# Altium project opm.PrjPcb (part 11 of 11)

## Sheet thermal.SchDoc: Thermal Monitoring
size A4; Author: Peilin Perry Xu; CompanyName: N/A; DrawnBy: Peilin Perry Xu; Engineer: Peilin Perry Xu; Organization: N/A; Address1: 89 Chestnut Street, Toronto. ON, Canada; Address2: 79 Brass Drive, Richmond Hill, ON, Canada; DocumentNumber: 7; Revision: 2; SheetNumber: 10; SheetTotal: 11
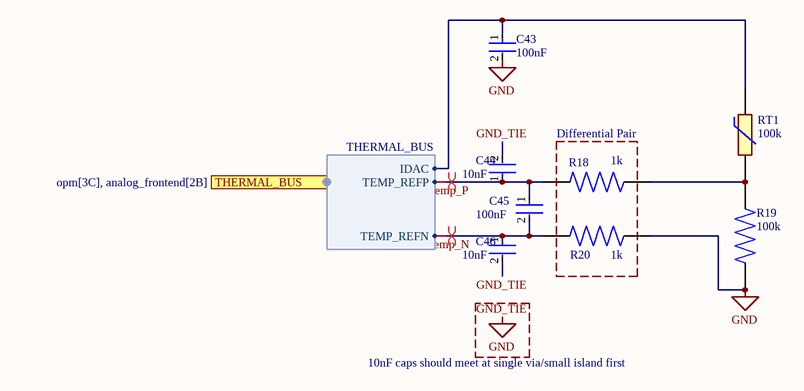
[diagram p10: thermal.SchDoc]

### Parts
C43  100nF  [GRM3195C1H104JA05D]
C44  10nF  [GRM1885C1H103JA01D]
C45  100nF  [GRM3195C1H104JA05D]
C46  10nF  [GRM1885C1H103JA01D]
R18  1k  [RESC1508X55N]
R19  100k  [RESC1508X55N]
R20  1k  [RESC1508X55N]
RT1  100k  [104JT-025]

### Blocks framed on the sheet
Differential Pair: R18 R20

### Ports
THERMAL_BUS (harness THERMAL_BUS, see opm[3C], analog_frontend[2B])

### Harnesses
THERMAL_BUS: IDAC, TEMP_REFN, TEMP_REFP

### Nets
GND: C43.2 C44.2 C46.2 R19.2 R20.2  [also labelled GND_TIE]  [project net DGND]
Temp_N: C45.2 C46.1 R20.1 ; port THERMAL_BUS.TEMP_REFN
Temp_P: C44.1 C45.1 R18.1 ; port THERMAL_BUS.TEMP_REFP
NetC43_1: C43.1 RT1.1 ; port THERMAL_BUS.IDAC
NetR18_2: R18.2 R19.1 RT1.2

### Layout directives
differential pair: Temp_N, Temp_P

### Notes on the sheet
- 10nF caps should meet at single via/small island first

### Library data of the parts
C43 C45 = GRM3195C1H104JA05D: 50V 100nF C0G ±5% 1206 Multilayer Ceramic Capacitors MLCC - SMD/SMT ROHS; Manufacturer: Murata; Manufacturer Lifecycle Status: IN PRODUCTION; Temperature Coefficient: 30ppm/°C; Supplier: DigiKey; Supplier Part Number: 490-GRM3195C1H104JA05DCT-ND; Manufacturer Part Number: GRM3195C1H104JA05D; RoHS: Compliant; Category: Ceramic Capacitors; Stock: 3015; Pricing: 1=0.34, 10=0.199, 50=0.146, 100=0.1298, 500=0.10224, 1000=0.09376 (USD); Value: 100nF; Case/Package: 1206; Dielectric Material: Ceramic; Height: 850µm; Length: 3.2mm; Lifecycle Status: Production; Material: Ceramic; Max Operating Temperature: 125°C; Min Operating Temperature: -55°C; Mounting Technology: Surface Mount; Number of Terminals: 2; REACH SVHC: Yes; Thickness: 850µm; Tolerance: 5%; Voltage Rating: 50V; Voltage Rating (DC): 50V; Width: 1.6mm; ComponentLink1URL: https://datasheet.octopart.com:443/GRM3195C1H104JA05D-Murata-datasheet-141279025.pdf?src-supplier=Geoflip; ComponentLink1Description: https://datasheet.octopart.com:443/GRM3195C1H104JA05D-Murata-datasheet-141279025.pdf?src-supplier=Geoflip; ComponentLink2URL: https://datasheet.octopart.com:443/GRM3195C1H104JA05D-Murata-datasheet-165579666.pdf?src-supplier=TME; ComponentLink2Description: https://datasheet.octopart.com:443/GRM3195C1H104JA05D-Murata-datasheet-165579666.pdf?src-supplier=TME; ComponentLink3URL: https://datasheet.octopart.com:443/GRM3195C1H104JA05D-Murata-datasheet-140707903.pdf?src-supplier=Ciiva; ComponentLink3Description: https://datasheet.octopart.com:443/GRM3195C1H104JA05D-Murata-datasheet-140707903.pdf?src-supplier=Ciiva; ComponentLink4URL: https://datasheet.octopart.com:443/GRM3195C1H104JA05D-Murata-datasheet-138745203.pdf?src-supplier=Ciiva; ComponentLink4Description: https://datasheet.octopart.com:443/GRM3195C1H104JA05D-Murata-datasheet-138745203.pdf?src-supplier=Ciiva; ComponentLink5URL: https://datasheet.octopart.com/GRM3195C1H104JA05D-Murata-datasheet-12515295.pdf; ComponentLink5Description: https://datasheet.octopart.com/GRM3195C1H104JA05D-Murata-datasheet-12515295.pdf; ComponentLink6URL: https://datasheet.octopart.com/GRM3195C1H104JA05D-Murata-datasheet-12510076.pdf; ComponentLink6Description: https://datasheet.octopart.com/GRM3195C1H104JA05D-Murata-datasheet-12510076.pdf; ComponentLink7URL: https://datasheet.octopart.com/GRM3195C1H104JA05D-Murata-datasheet-11978611.pdf; ComponentLink7Description: https://datasheet.octopart.com/GRM3195C1H104JA05D-Murata-datasheet-11978611.pdf; ComponentLink8URL: https://datasheet.octopart.com/GRM3195C1H104JA05D-Murata-datasheet-10025737.pdf; ComponentLink8Description: https://datasheet.octopart.com/GRM3195C1H104JA05D-Murata-datasheet-10025737.pdf; ComponentLink9URL: https://datasheet.octopart.com/GRM3195C1H104JA05D-Murata-datasheet-8819587.pdf; ComponentLink9Description: https://datasheet.octopart.com/GRM3195C1H104JA05D-Murata-datasheet-8819587.pdf; ComponentLink10URL: http://sigma.octopart.com:80/reach_statement/Murata-company-16.pdf?src-supplier=Compliance+Statements; ComponentLink10Description: http://sigma.octopart.com:80/reach_statement/Murata-company-16.pdf?src-supplier=Compliance+Statements; Supplier 1: DigiKey; Supplier Part Number 1: 490-GRM3195C1H104JA05DCT-ND
C44 C46 = GRM1885C1H103JA01D: Multilayer Ceramic Capacitor, Grm Series, 0.01 F, 5%, C0g / Np0, 50 V, 0603 [1608 Metric]; Manufacturer: Murata; Manufacturer Lifecycle Status: IN PRODUCTION; Temperature Coefficient: 30ppm/°C; Voltage: 50V; Supplier: DigiKey; Supplier Part Number: 490-9666-1-ND; Manufacturer Part Number: GRM1885C1H103JA01D; RoHS: Compliant; Category: Ceramic Capacitors; Stock: 561745; Pricing: 1=0.12, 10=0.064, 50=0.0446, 100=0.0386, 500=0.02864, 1000=0.02721 (USD); Value: 10nF; Case/Package: 0603; Case Code (Imperial): 0603; Case Code (Metric): 1608; Depth: 800µm; Dielectric: C0G; Dielectric Material: Ceramic; Height: 800µm; Lead Free: Lead Free; Lead Pitch: 500µm; Length: 1.6mm; Lifecycle Status: Production; Material: Ceramic; Max Operating Temperature: 125°C; Min Operating Temperature: -55°C; Mounting Technology: Surface Mount; Number of Terminals: 2; Packaging: Cut Tape; REACH SVHC: Yes; Schedule B: 8532240020, 8532240020|8532240020, 8532240020|8532240020|8532240020, 8532240020|8532240020|8532240020|8532240020; Termination: SMD/SMT; Thickness: 800µm; Tolerance: 5%; Voltage Rating: 50V; Voltage Rating (DC): 50V; Width: 800µm; ComponentLink1URL: https://datasheet.octopart.com:443/GRM1885C1H103JA01D-Murata-datasheet-34231350.pdf?src-supplier=Newark; ComponentLink1Description: https://datasheet.octopart.com:443/GRM1885C1H103JA01D-Murata-datasheet-34231350.pdf?src-supplier=Newark; ComponentLink2URL: https://datasheet.octopart.com:443/GRM1885C1H103JA01D-Murata-datasheet-62317145.pdf?src-supplier=element14+APAC; ComponentLink2Description: https://datasheet.octopart.com:443/GRM1885C1H103JA01D-Murata-datasheet-62317145.pdf?src-supplier=element14+APAC; ComponentLink3URL: https://datasheet.octopart.com:443/GRM1885C1H103JA01D-Murata-datasheet-15634865.pdf?src-supplier=Future+Electronics; ComponentLink3Description: https://datasheet.octopart.com:443/GRM1885C1H103JA01D-Murata-datasheet-15634865.pdf?src-supplier=Future+Electronics; ComponentLink4URL: https://datasheet.octopart.com:443/GRM1885C1H103JA01D-Murata-datasheet-22122223.pdf?src-supplier=Future+Electronics; ComponentLink4Description: https://datasheet.octopart.com:443/GRM1885C1H103JA01D-Murata-datasheet-22122223.pdf?src-supplier=Future+Electronics; ComponentLink5URL: https://datasheet.octopart.com:443/GRM1885C1H103JA01D-Murata-datasheet-44106831.pdf?src-supplier=Future+Electronics; ComponentLink5Description: https://datasheet.octopart.com:443/GRM1885C1H103JA01D-Murata-datasheet-44106831.pdf?src-supplier=Future+Electronics; ComponentLink6URL: https://datasheet.octopart.com:443/GRM1885C1H103JA01D-Murata-datasheet-165579666.pdf?src-supplier=TME; ComponentLink6Description: https://datasheet.octopart.com:443/GRM1885C1H103JA01D-Murata-datasheet-165579666.pdf?src-supplier=TME; ComponentLink7URL: https://datasheet.octopart.com:443/GRM1885C1H103JA01D-Murata-datasheet-86177052.pdf?src-supplier=TME; ComponentLink7Description: https://datasheet.octopart.com:443/GRM1885C1H103JA01D-Murata-datasheet-86177052.pdf?src-supplier=TME; ComponentLink8URL: https://datasheet.octopart.com:443/GRM1885C1H103JA01D-Murata-datasheet-141274262.pdf?src-supplier=Ciiva; ComponentLink8Description: https://datasheet.octopart.com:443/GRM1885C1H103JA01D-Murata-datasheet-141274262.pdf?src-supplier=Ciiva; ComponentLink9URL: https://datasheet.octopart.com:443/GRM1885C1H103JA01D-Murata-datasheet-140695819.pdf?src-supplier=Ciiva; ComponentLink9Description: https://datasheet.octopart.com:443/GRM1885C1H103JA01D-Murata-datasheet-140695819.pdf?src-supplier=Ciiva; ComponentLink10URL: https://datasheet.octopart.com:443/GRM1885C1H103JA01D-Murata-datasheet-138741457.pdf?src-supplier=Ciiva; ComponentLink10Description: https://datasheet.octopart.com:443/GRM1885C1H103JA01D-Murata-datasheet-138741457.pdf?src-supplier=Ciiva; ComponentLink11URL: https://datasheet.octopart.com/GRM1885C1H103JA01D-Murata-datasheet-12515295.pdf; ComponentLink11Description: https://datasheet.octopart.com/GRM1885C1H103JA01D-Murata-datasheet-12515295.pdf; ComponentLink12URL: https://datasheet.octopart.com/GRM1885C1H103JA01D-Murata-datasheet-12510076.pdf; ComponentLink12Description: https://datasheet.octopart.com/GRM1885C1H103JA01D-Murata-datasheet-12510076.pdf; ComponentLink13URL: https://datasheet.octopart.com/GRM1885C1H103JA01D-Murata-datasheet-11978611.pdf; ComponentLink13Description: https://datasheet.octopart.com/GRM1885C1H103JA01D-Murata-datasheet-11978611.pdf; ComponentLink14URL: https://datasheet.octopart.com/GRM1885C1H103JA01D-Murata-datasheet-10025737.pdf; ComponentLink14Description: https://datasheet.octopart.com/GRM1885C1H103JA01D-Murata-datasheet-10025737.pdf; ComponentLink15URL: https://datasheet.octopart.com/GRM1885C1H103JA01D-Murata-datasheet-8819587.pdf; ComponentLink15Description: https://datasheet.octopart.com/GRM1885C1H103JA01D-Murata-datasheet-8819587.pdf; ComponentLink16URL: http://sigma.octopart.com:80/reach_statement/Murata-company-16.pdf?src-supplier=Compliance+Statements; ComponentLink16Description: http://sigma.octopart.com:80/reach_statement/Murata-company-16.pdf?src-supplier=Compliance+Statements; Supplier 1: DigiKey; Supplier Part Number 1: 490-9666-1-ND
R18 R20 = TNPW06031K00BXEN: Fixed Resistor, Thin Film, 0.1W, 1000ohm, 75V, 0.1% +/-Tol, 15ppm/Cel, Surface Mount, 0603; Manufacturer: Vishay; Max Power Dissipation: 100mW; Value: 1kΩ; Temperature Coefficient: 15ppm/°C; Supplier: DigiKey; Supplier Part Number: 541-1724-1-ND; Manufacturer Part Number: TNPW06031K00BXEN; RoHS: Compliant; Category: Chip SMD Resistors; Stock: 1829; Pricing: 1=0.66, 10=0.548, 25=0.5076, 50=0.4798, 100=0.454, 250=0.42332, 500=0.40256 (USD); Case/Package: 0603; Case Code (Imperial): 0603; Case Code (Metric): 1608; China RoHS: Compliant; Composition: Thin Film; Contact Plating: Tin; Country of Origin: Germany, Israel; Depth: 850µm; Export Control Classification Number (ECCN) Code: EAR99; Features: Anti-Sulfur, Automotive AEC-Q200, Moisture Resistant; Height: 450µm; Harmonized Tariff Schedule (HTS) Code: 8533.21.00.30; Introduction Date: 2008-07-30; Length: 1.6002mm; Lifecycle Status: Production; Max Operating Temperature: 125°C; Military Standard: Not; Min Operating Temperature: -55°C; Mounting Technology: Surface Mount; Number of Terminals: 2; Number of Terminations: 2; Packaging: Digi-Reel®; Power Dissipation: 100mW; Power Rating: 100mW; Radiation Hardening: No; REACH SVHC: Yes; Schedule B: 8533210045, 8533210045|8533210045|8533210045|8533210045|8533210045|8533210045|8533210045|8533210045|8533210045|8533210045|8533210045|8533210045|8533210045|8533210045|8533210045|8533210045|8533210045|8533210045|8533210045|8533210045|8533210045|8533210045|8533210045|85; Tolerance: 0.1%; Width: 850µm; Working Voltage: 75V; ComponentLink1URL: https://datasheet.octopart.com:443/TNPW06031K00BXEN-Vishay-datasheet-170520403.pdf?src-supplier=IHS; ComponentLink1Description: https://datasheet.octopart.com:443/TNPW06031K00BXEN-Vishay-datasheet-170520403.pdf?src-supplier=IHS; ComponentLink2URL: https://datasheet.octopart.com:443/TNPW06031K00BXEN-Vishay-Dale-datasheet-182026744.pdf?src-supplier=IHS; ComponentLink2Description: https://datasheet.octopart.com:443/TNPW06031K00BXEN-Vishay-Dale-datasheet-182026744.pdf?src-supplier=IHS; ComponentLink3URL: https://datasheet.octopart.com:443/TNPW06031K00BXEN-Vishay-datasheet-79783896.pdf?src-supplier=Future+Electronics; ComponentLink3Description: https://datasheet.octopart.com:443/TNPW06031K00BXEN-Vishay-datasheet-79783896.pdf?src-supplier=Future+Electronics; ComponentLink4URL: https://datasheet.octopart.com/TNPW06031K00BXEN-Vishay-datasheet-13498837.pdf; ComponentLink4Description: https://datasheet.octopart.com/TNPW06031K00BXEN-Vishay-datasheet-13498837.pdf; ComponentLink5URL: https://datasheet.octopart.com/TNPW06031K00BXEN-Vishay-datasheet-13414878.pdf; ComponentLink5Description: https://datasheet.octopart.com/TNPW06031K00BXEN-Vishay-datasheet-13414878.pdf; ComponentLink6URL: https://datasheet.octopart.com/TNPW06031K00BXEN-Vishay-datasheet-13295955.pdf; ComponentLink6Description: https://datasheet.octopart.com/TNPW06031K00BXEN-Vishay-datasheet-13295955.pdf; ComponentLink7URL: https://datasheet.octopart.com/TNPW06031K00BXEN-Vishay-datasheet-13196373.pdf; ComponentLink7Description: https://datasheet.octopart.com/TNPW06031K00BXEN-Vishay-datasheet-13196373.pdf; ComponentLink8URL: https://datasheet.octopart.com/TNPW06031K00BXEN-Vishay-datasheet-13143890.pdf; ComponentLink8Description: https://datasheet.octopart.com/TNPW06031K00BXEN-Vishay-datasheet-13143890.pdf; ComponentLink9URL: https://datasheet.octopart.com/TNPW06031K00BXEN-Vishay-datasheet-13081780.pdf; ComponentLink9Description: https://datasheet.octopart.com/TNPW06031K00BXEN-Vishay-datasheet-13081780.pdf; ComponentLink10URL: https://datasheet.octopart.com/TNPW06031K00BXEN-Vishay-datasheet-13052401.pdf; ComponentLink10Description: https://datasheet.octopart.com/TNPW06031K00BXEN-Vishay-datasheet-13052401.pdf; ComponentLink11URL: https://datasheet.octopart.com/TNPW06031K00BXEN-Vishay-datasheet-13034137.pdf; ComponentLink11Description: https://datasheet.octopart.com/TNPW06031K00BXEN-Vishay-datasheet-13034137.pdf; ComponentLink12URL: https://datasheet.octopart.com/TNPW06031K00BXEN-Vishay-datasheet-12585086.pdf; ComponentLink12Description: https://datasheet.octopart.com/TNPW06031K00BXEN-Vishay-datasheet-12585086.pdf; ComponentLink13URL: https://datasheet.octopart.com/TNPW06031K00BXEN-Vishay-datasheet-12543131.pdf; ComponentLink13Description: https://datasheet.octopart.com/TNPW06031K00BXEN-Vishay-datasheet-12543131.pdf; ComponentLink14URL: https://datasheet.octopart.com/TNPW06031K00BXEN-Vishay-datasheet-12532511.pdf; ComponentLink14Description: https://datasheet.octopart.com/TNPW06031K00BXEN-Vishay-datasheet-12532511.pdf; ComponentLink15URL: https://datasheet.octopart.com/TNPW06031K00BXEN-Vishay-datasheet-12519971.pdf; ComponentLink15Description: https://datasheet.octopart.com/TNPW06031K00BXEN-Vishay-datasheet-12519971.pdf; ComponentLink16URL: https://datasheet.octopart.com/TNPW06031K00BXEN-Vishay-datasheet-12509767.pdf; ComponentLink16Description: https://datasheet.octopart.com/TNPW06031K00BXEN-Vishay-datasheet-12509767.pdf; ComponentLink17URL: https://datasheet.octopart.com/TNPW06031K00BXEN-Vishay-datasheet-12365287.pdf; ComponentLink17Description: https://datasheet.octopart.com/TNPW06031K00BXEN-Vishay-datasheet-12365287.pdf; ComponentLink18URL: https://datasheet.octopart.com/TNPW06031K00BXEN-Vishay-datasheet-10854096.pdf; ComponentLink18Description: https://datasheet.octopart.com/TNPW06031K00BXEN-Vishay-datasheet-10854096.pdf; ComponentLink19URL: https://datasheet.octopart.com/TNPW06031K00BXEN-Vishay-datasheet-10678752.pdf; ComponentLink19Description: https://datasheet.octopart.com/TNPW06031K00BXEN-Vishay-datasheet-10678752.pdf; ComponentLink20URL: https://datasheet.octopart.com/TNPW06031K00BXEN-Vishay-datasheet-10283461.pdf; ComponentLink20Description: https://datasheet.octopart.com/TNPW06031K00BXEN-Vishay-datasheet-10283461.pdf; ComponentLink21URL: https://datasheet.octopart.com/TNPW06031K00BXEN-Vishay-datasheet-10185418.pdf; ComponentLink21Description: https://datasheet.octopart.com/TNPW06031K00BXEN-Vishay-datasheet-10185418.pdf; ComponentLink22URL: https://datasheet.octopart.com/TNPW06031K00BXEN-Vishay-datasheet-10055244.pdf; ComponentLink22Description: https://datasheet.octopart.com/TNPW06031K00BXEN-Vishay-datasheet-10055244.pdf; ComponentLink23URL: http://sigma.octopart.com:80/rohs_statement/Vishay-company-15.pdf?src-supplier=Compliance+Statements; ComponentLink23Description: http://sigma.octopart.com:80/rohs_statement/Vishay-company-15.pdf?src-supplier=Compliance+Statements; Supplier 1: DigiKey; Supplier Part Number 1: 541-1724-1-ND
R19 = TNPW0603100KBXEN: Fixed Resistor, Thin Film, 0.1W, 100000ohm, 75V, 0.1% +/-Tol, 15ppm/Cel, Surface Mount, 0603; Manufacturer: Vishay; Max Power Dissipation: 100mW; Value: 100kΩ; Temperature Coefficient: 15ppm/°C; Supplier: DigiKey; Supplier Part Number: 541-1721-1-ND; Manufacturer Part Number: TNPW0603100KBXEN; RoHS: Compliant; Category: Chip SMD Resistors; Stock: 1476; Pricing: 1=0.67, 10=0.559, 25=0.5184, 50=0.49, 100=0.4637, 250=0.43236, 500=0.41122 (USD); Case/Package: 0603; Case Code (Imperial): 0603; Case Code (Metric): 1608; China RoHS: Compliant; Composition: Thin Film; Contact Plating: Tin; Depth: 850µm; Features: Anti-Sulfur, Automotive AEC-Q200, Moisture Resistant; Height: 450µm; Length: 1.6002mm; Lifecycle Status: Production; Max Operating Temperature: 125°C; Military Standard: Not; Min Operating Temperature: -55°C; Mounting Technology: Surface Mount; Number of Terminals: 2; Number of Terminations: 2; Packaging: Digi-Reel®; Power Dissipation: 100mW; Power Rating: 100mW; Radiation Hardening: No; REACH SVHC: Yes; Schedule B: 8533210045, 8533210045|8533210045|8533210045|8533210045|8533210045; Tolerance: 0.1%; Width: 850µm; Working Voltage: 75V; ComponentLink1URL: https://datasheet.octopart.com:443/TNPW0603100KBXEN-Vishay-datasheet-170520403.pdf?src-supplier=IHS; ComponentLink1Description: https://datasheet.octopart.com:443/TNPW0603100KBXEN-Vishay-datasheet-170520403.pdf?src-supplier=IHS; ComponentLink2URL: https://datasheet.octopart.com:443/TNPW0603100KBXEN-Vishay-Dale-datasheet-182026744.pdf?src-supplier=IHS; ComponentLink2Description: https://datasheet.octopart.com:443/TNPW0603100KBXEN-Vishay-Dale-datasheet-182026744.pdf?src-supplier=IHS; ComponentLink3URL: https://datasheet.octopart.com:443/TNPW0603100KBXEN-Vishay-datasheet-79783896.pdf?src-supplier=Future+Electronics; ComponentLink3Description: https://datasheet.octopart.com:443/TNPW0603100KBXEN-Vishay-datasheet-79783896.pdf?src-supplier=Future+Electronics; ComponentLink4URL: https://datasheet.octopart.com/TNPW0603100KBXEN-Vishay-datasheet-13498837.pdf; ComponentLink4Description: https://datasheet.octopart.com/TNPW0603100KBXEN-Vishay-datasheet-13498837.pdf; ComponentLink5URL: https://datasheet.octopart.com/TNPW0603100KBXEN-Vishay-datasheet-13414878.pdf; ComponentLink5Description: https://datasheet.octopart.com/TNPW0603100KBXEN-Vishay-datasheet-13414878.pdf; ComponentLink6URL: https://datasheet.octopart.com/TNPW0603100KBXEN-Vishay-datasheet-13295955.pdf; ComponentLink6Description: https://datasheet.octopart.com/TNPW0603100KBXEN-Vishay-datasheet-13295955.pdf; ComponentLink7URL: https://datasheet.octopart.com/TNPW0603100KBXEN-Vishay-datasheet-13196373.pdf; ComponentLink7Description: https://datasheet.octopart.com/TNPW0603100KBXEN-Vishay-datasheet-13196373.pdf; ComponentLink8URL: https://datasheet.octopart.com/TNPW0603100KBXEN-Vishay-datasheet-13143890.pdf; ComponentLink8Description: https://datasheet.octopart.com/TNPW0603100KBXEN-Vishay-datasheet-13143890.pdf; ComponentLink9URL: https://datasheet.octopart.com/TNPW0603100KBXEN-Vishay-datasheet-13081780.pdf; ComponentLink9Description: https://datasheet.octopart.com/TNPW0603100KBXEN-Vishay-datasheet-13081780.pdf; ComponentLink10URL: https://datasheet.octopart.com/TNPW0603100KBXEN-Vishay-datasheet-13052401.pdf; ComponentLink10Description: https://datasheet.octopart.com/TNPW0603100KBXEN-Vishay-datasheet-13052401.pdf; ComponentLink11URL: https://datasheet.octopart.com/TNPW0603100KBXEN-Vishay-datasheet-13034137.pdf; ComponentLink11Description: https://datasheet.octopart.com/TNPW0603100KBXEN-Vishay-datasheet-13034137.pdf; ComponentLink12URL: https://datasheet.octopart.com/TNPW0603100KBXEN-Vishay-datasheet-12585086.pdf; ComponentLink12Description: https://datasheet.octopart.com/TNPW0603100KBXEN-Vishay-datasheet-12585086.pdf; ComponentLink13URL: https://datasheet.octopart.com/TNPW0603100KBXEN-Vishay-datasheet-12543131.pdf; ComponentLink13Description: https://datasheet.octopart.com/TNPW0603100KBXEN-Vishay-datasheet-12543131.pdf; ComponentLink14URL: https://datasheet.octopart.com/TNPW0603100KBXEN-Vishay-datasheet-12532511.pdf; ComponentLink14Description: https://datasheet.octopart.com/TNPW0603100KBXEN-Vishay-datasheet-12532511.pdf; ComponentLink15URL: https://datasheet.octopart.com/TNPW0603100KBXEN-Vishay-datasheet-12519971.pdf; ComponentLink15Description: https://datasheet.octopart.com/TNPW0603100KBXEN-Vishay-datasheet-12519971.pdf; ComponentLink16URL: https://datasheet.octopart.com/TNPW0603100KBXEN-Vishay-datasheet-12509767.pdf; ComponentLink16Description: https://datasheet.octopart.com/TNPW0603100KBXEN-Vishay-datasheet-12509767.pdf; ComponentLink17URL: https://datasheet.octopart.com/TNPW0603100KBXEN-Vishay-datasheet-12365287.pdf; ComponentLink17Description: https://datasheet.octopart.com/TNPW0603100KBXEN-Vishay-datasheet-12365287.pdf; ComponentLink18URL: https://datasheet.octopart.com/TNPW0603100KBXEN-Vishay-datasheet-10854096.pdf; ComponentLink18Description: https://datasheet.octopart.com/TNPW0603100KBXEN-Vishay-datasheet-10854096.pdf; ComponentLink19URL: https://datasheet.octopart.com/TNPW0603100KBXEN-Vishay-datasheet-10678752.pdf; ComponentLink19Description: https://datasheet.octopart.com/TNPW0603100KBXEN-Vishay-datasheet-10678752.pdf; ComponentLink20URL: https://datasheet.octopart.com/TNPW0603100KBXEN-Vishay-datasheet-10283461.pdf; ComponentLink20Description: https://datasheet.octopart.com/TNPW0603100KBXEN-Vishay-datasheet-10283461.pdf; ComponentLink21URL: https://datasheet.octopart.com/TNPW0603100KBXEN-Vishay-datasheet-10185418.pdf; ComponentLink21Description: https://datasheet.octopart.com/TNPW0603100KBXEN-Vishay-datasheet-10185418.pdf; ComponentLink22URL: https://datasheet.octopart.com/TNPW0603100KBXEN-Vishay-datasheet-10055244.pdf; ComponentLink22Description: https://datasheet.octopart.com/TNPW0603100KBXEN-Vishay-datasheet-10055244.pdf; ComponentLink23URL: http://sigma.octopart.com:80/rohs_statement/Vishay-company-15.pdf?src-supplier=Compliance+Statements; ComponentLink23Description: http://sigma.octopart.com:80/rohs_statement/Vishay-company-15.pdf?src-supplier=Compliance+Statements; Supplier 1: DigiKey; Supplier Part Number 1: 541-1721-1-ND
RT1 = 104JT-025: NTC Thermistor, 100000ohm, Through Hole Mount; Manufacturer: Semitec; Power Dissipation: 3.5mW; Value: 100kΩ; Tolerance: 1%; Supplier: DigiKey; Supplier Part Number: 4316-104JT-025-ND; Manufacturer Part Number: 104JT-025; RoHS: Compliant; Category: Resistors; Stock: 475; Pricing: 1=0.64, 5=0.558, 10=0.529, 25=0.4936, 50=0.4696, 100=0.4477, 500=0.40388, 1000=0.38759, 5000=0.35483 (USD); Export Control Classification Number (ECCN) Code: EAR99; Harmonized Tariff Schedule (HTS) Code: 8533.40.80.70; Max Operating Temperature: 125°C; Min Operating Temperature: -50°C; Number of Terminals: 2; ComponentLink1URL: https://datasheet.octopart.com:443/104JT-025-Semitec-datasheet-182147835.pdf?src-supplier=IHS; ComponentLink1Description: https://datasheet.octopart.com:443/104JT-025-Semitec-datasheet-182147835.pdf?src-supplier=IHS; Supplier 1: DigiKey; Supplier Part Number 1: 4316-104JT-025-ND

## Nets that join several sheets
+3V3_A: analog_frontend (C2.1 U1.12), tia2 (C9.1 C11.1 U4.2 U5.5), tia1 (C6.1 C8.1 U2.2 U3.5), tia3 (C12.1 C14.1 U6.2 U7.5), regulation (C39.1 C40.1 FB3.2)
+3V3_D: analog_frontend (C1.1 U1.13), mcu (10 pins), interface (C22.1 U9.14), charger (R16.1), regulation (C42.1 U12.5)
DGND: analog_frontend (9 pins), tia2 (6 pins), tia1 (6 pins), tia3 (6 pins), mcu (9 pins), interface (6 pins), battery (5 pins), charger (7 pins), regulation (10 pins), thermal (5 pins)
VBAT: battery (J2.1), regulation (6 pins)
VBUS_ISO: interface (C24.2 PS1.4 R14.1), charger (C30.2 C31.1 FB2.2)
ADC_CS: analog_frontend (U1.2), mcu (R22.1)
ADC_DIN: analog_frontend (U1.16), mcu (R24.1)
ADC_DOUT: analog_frontend (R2.2), mcu (U13.12)
ADC_DRDY: analog_frontend (R1.2), mcu (U13.14)
ADC_SCLK: analog_frontend (U1.1), mcu (R23.1)
NetC3_1: analog_frontend (C3.1 U1.11), tia3 (R8.2)
NetC4_1: analog_frontend (C4.1 U1.10), tia2 (R6.2)
NetC5_1: analog_frontend (C5.1 U1.7), tia1 (R4.2)
NetC34_1: battery (J4.1), charger (C34.1 U10.3)
NetC43_1: analog_frontend (U1.6), thermal (C43.1 RT1.1)
NetPD1_K: analog_frontend (PD1.K), tia2 (U4.5), tia1 (U2.5), tia3 (U6.5)
NetR16_2: mcu (U13.15), charger (R16.2 U10.1)
NetR25_1: mcu (R25.1), interface (U9.13)
NetR27_1: mcu (R27.1), interface (U9.12)
SEL1: tia3 (U6.1), mcu (U13.6)
SEL2: tia2 (U4.1), mcu (U13.7)
SEL3: tia1 (U2.1), mcu (U13.8)
Temp_N: analog_frontend (U1.8), thermal (C45.2 C46.1 R20.1)
Temp_P: analog_frontend (U1.9), thermal (C44.1 C45.1 R18.1)